# EAGLE design spaceloop_controller (EAGLE 7.6.0)
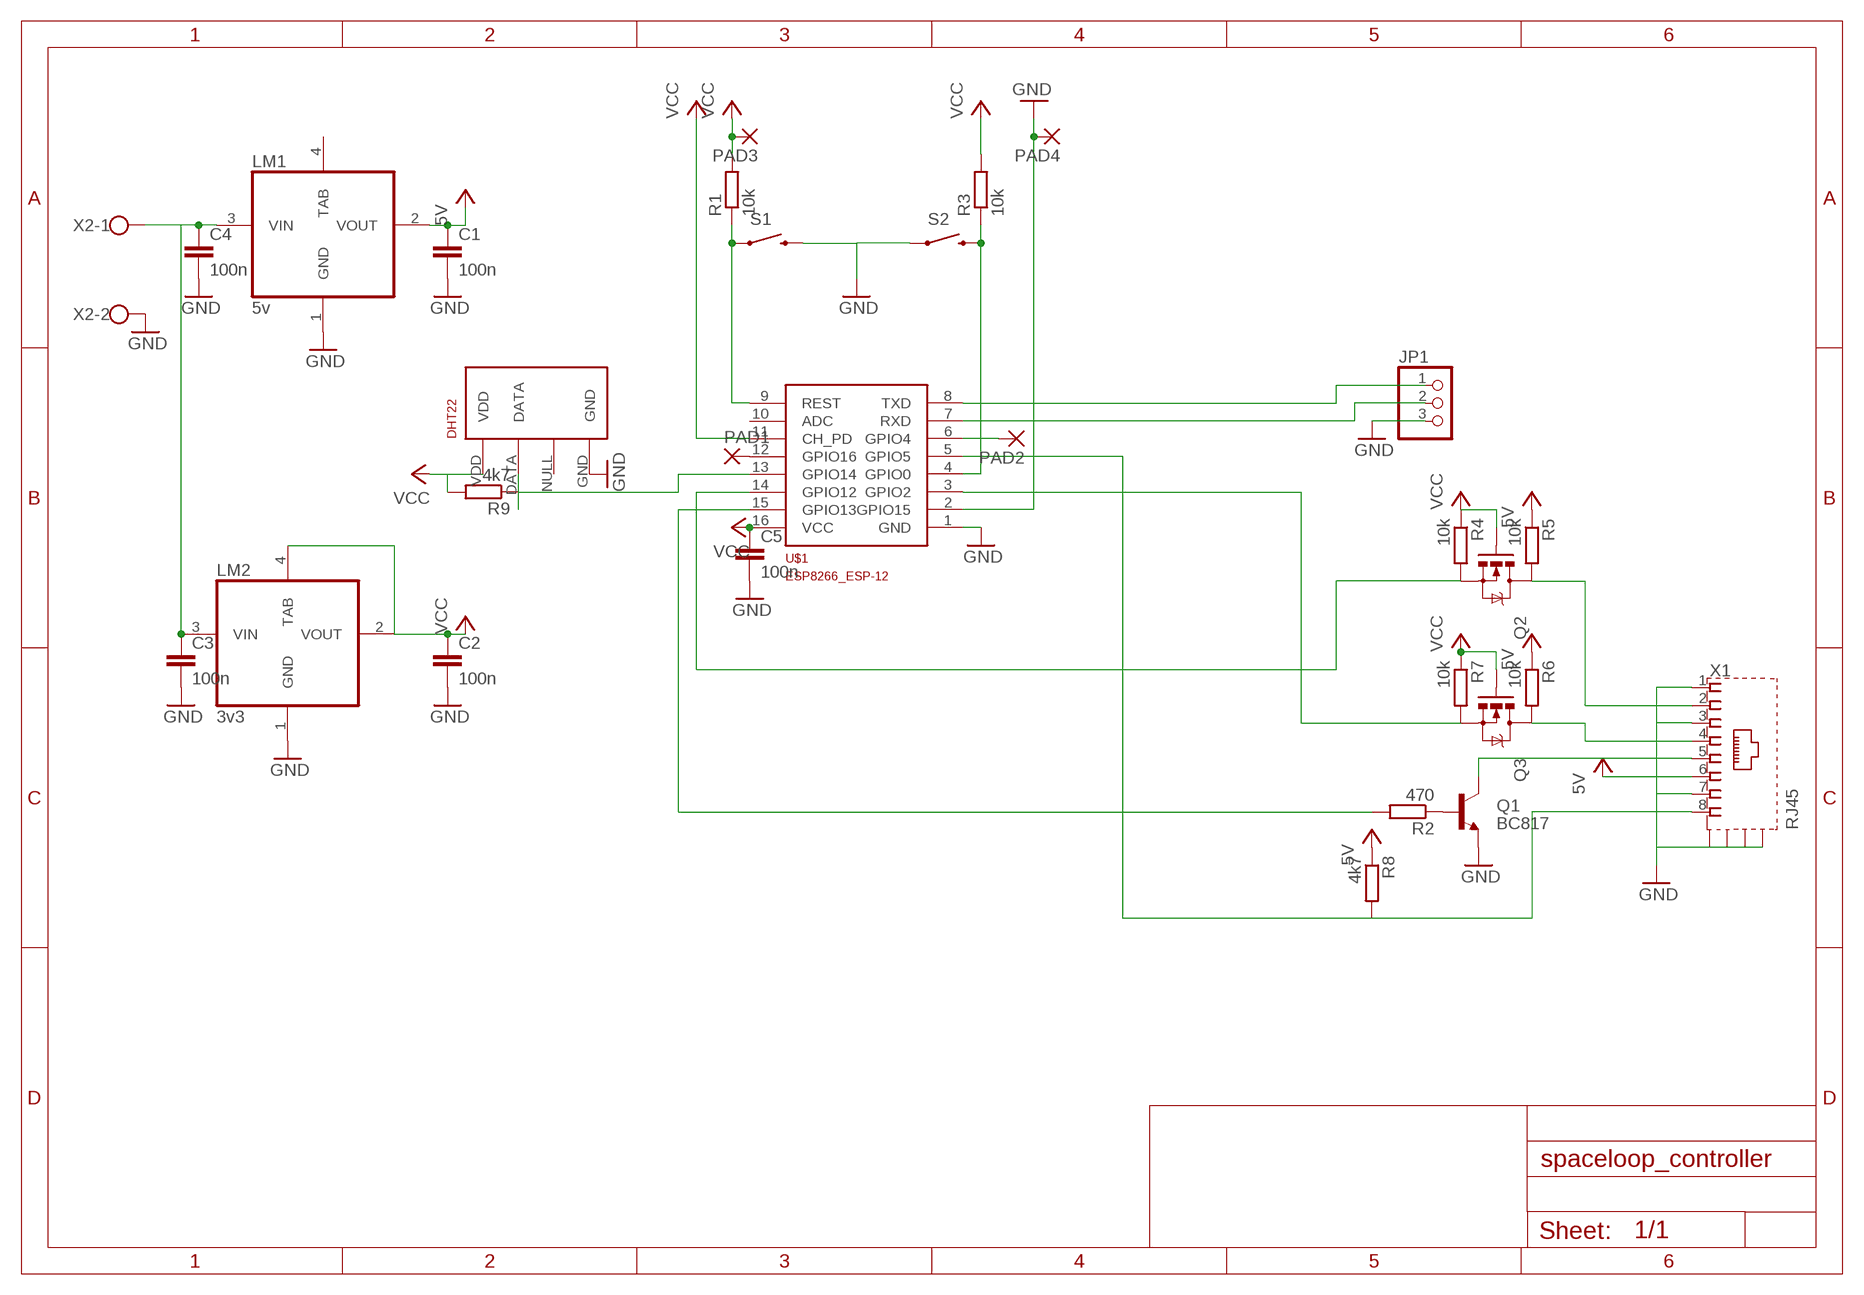
[diagram p0: schematic, sheet 1]

## Parts
C1  100n  C-EUC0805  [C0805]
C2  100n  C-EUC0805  [C0805]
C3  100n  C-EUC0805  [C0805]
C4  100n  C-EUC0805  [C0805]
C5  100n  C-EUC0805  [C0805]
DHT22  RHT03_DHT-22_AM2302WIRED  [AM2302]
JP1  PINHD-1X3  [1X03]
LM1  5v  REG1117  [SOT223]
LM2  3v3  REG1117  [SOT223]
PAD1  SMD2  [SMD1,27-2,54]
PAD2  SMD2  [SMD1,27-2,54]
PAD3  SMD2  [SMD1,27-2,54]
PAD4  SMD2  [SMD1,27-2,54]
Q1  BC817  TRANSISTOR_NPNSOT23-3  [SOT23-3]
Q2  BSS138  MOSFET-NCHANNELBSS138  [SOT23-3]
Q3  BSS138  MOSFET-NCHANNELBSS138  [SOT23-3]
R1  10k  R-EU_R0805  [R0805]
R2  470  R-EU_R0805  [R0805]
R3  10k  R-EU_R0805  [R0805]
R4  10k  R-EU_R0805  [R0805]
R5  10k  R-EU_R0805  [R0805]
R6  10k  R-EU_R0805  [R0805]
R7  10k  R-EU_R0805  [R0805]
R8  4k7  R-EU_R0805  [R0805]
R9  4k7  R-EU_R0805  [R0805]
S1  SWITCH-MOMENTARY-2SMD-1101NE  [TACTILE-SWITCH-1101NE]
S2  SWITCH-MOMENTARY-2SMD-1101NE  [TACTILE-SWITCH-1101NE]
U$1  ESP8266_ESP-12  [ESP8266-ESP12]
X1  RJ45  RJ45-6L2-B  [RJ45-SHIELD2]
X2  W237-102  [W237-102]

## Nets
+5V: C1.1 LM1.2(VOUT) R5.1 R6.1 R8.1 X1.6 ; supply symbol labelled 5V
GND: C1.2 C2.2 C3.2 C4.2 C5.2 DHT22.GND JP1.3 LM1.1(GND) LM2.1(GND) PAD4.1(P) Q1.2(E) S1.2 S2.1 U$1.1(GND) U$1.2(GPIO15) X1.1 X1.3 X1.7 X1.S1(S) X1.S2(S) X1.S3(S) X1.S4(S) X2.2
N$1: Q1.1(B) R2.1
N$2: Q1.3(C) X1.5
N$3: JP1.1 U$1.8(TXD)
N$4: JP1.2 U$1.7(RXD)
N$5: R1.1 S1.1 U$1.9(REST)
N$6: R3.1 S2.2 U$1.4(GPIO0)
N$7: PAD1.1(P) U$1.12(GPIO16)
N$8: Q2.2(S) R4.2 U$1.14(GPIO12)
N$10: Q3.2(S) R7.2 U$1.3(GPIO2)
N$11: Q3.3(D) R6.2 X1.4
N$12: R8.2 U$1.5(GPIO5) X1.8
N$13: PAD2.1(P) U$1.6(GPIO4)
N$14: R2.2 U$1.15(GPIO13)
N$16: DHT22.DATA R9.1 U$1.13(GPIO14)
N$17: C3.1 C4.1 LM1.3(VIN) LM2.3(VIN) X2.1
N$18: Q2.3(D) R5.2 X1.2
VCC: C2.1 C5.1 DHT22.VDD LM2.2(VOUT) LM2.4(TAB) PAD3.1(P) Q2.1(G) Q3.1(G) R1.2 R3.2 R4.1 R7.1 R9.2 U$1.11(CH_PD) U$1.16(VCC)
Unconnected: DHT22.NULL LM1.4(TAB) U$1.10(ADC)

## Library data of the parts
C1-C5 = rcl:C-EU: CAPACITOR, European symbol
DHT22 = RHT03_DHT-22_AM2302:RHT03_DHT-22_AM2302: RHT03 / DHT-22 / AM2302 Packages and symbol for the RHT03 / DHT-22 relative humidity and temperature sensor. Note: The AM2302 is a wired version of the DHT-22 which typically requires less clearance and is thus provided as a separate package.; PROD_ID: SEN-10167
JP1 = pinhead:PINHD-1X3: PIN HEADER
LM1 LM2 = BaseApp:REG1117: 800mA and 1A Low Dropout (LDO) Positive Regulator 1.8V, 2.5V, 2.85V, 3.3V, 5V, and Adj Digikey No :- __LM1117MPX-3.3CT-ND__
PAD1-PAD4 = wirepad:SMD2: SMD PAD
Q1 = SparkFun-DiscreteSemi:TRANSISTOR_NPN: Generic NPN BJT MMBT2222A - TRANS-08049 (SOT-23, 1A 40V) MPSA42 - TRANS-09116 (SOT-23, 500mA 300V) MMBT5088LT1G - TRANS-11160 (SOT-23, 50 mA 30V) BC547 - COM-08928 <http://www.sparkfun.com/products/8928> (TO-92 45V 100mA) (1.Collector 2.Base 3.Emitter) 2N3904 - COM-00521 <http://www.sparkfun.com/products/521> (TO-92 40V 200mA) (1.Emitter 2.Base 3.Collector) P2N2222A - COM-12852 <http://www.sparkfun.com/products/12852> (TO-92 40V 600mA) (1.Collector 2.Base 3.Emitter); PROD_ID: TRANS-08049
Q2 Q3 = SparkFun-DiscreteSemi:MOSFET-NCHANNEL: Common NMOSFET Parts MFG P/N Store ID Prod ID FDD8780 TRANS-09984 SI7820DN TRANS-11055 FDS6630A IC-08089 2N7002PW TRANS-11151 FQP30N06L COM-10213 TRANS-10060 BSS123LT1G TRANS-08345 BSS138 TRANS-00830 BS170 2N7000; PROD_ID: TRANS-00830; VALUE: 200mA/50V
R1-R9 = rcl:R-EU_: RESISTOR, European symbol
S1 S2 = SparkFun-Electromechanical:SWITCH-MOMENTARY-2: Various NO switches- pushbuttons, reed, etc; PROD_ID: SWCH-00815
U$1 = ESP8266-ESP12:ESP8266_ESP-12
X1 = con-tycoelectronics:RJ45*2: RJ45 Low Profile Shield Type 2 For all RJ45 L, LC, LCT and X Series Models Source: www.tycoelectronics.com .. ENG_DS_1654001_1099_RJ_L_0507.pdf; MPN: RJ45-6L2-B; OC_FARNELL: unknown; OC_NEWARK: 16R6096
X2 = con-wago-500:W237-102: WAGO SCREW CLAMP; MPN: 237-102; OC_FARNELL: unknown; OC_NEWARK: 70K9898

## Board
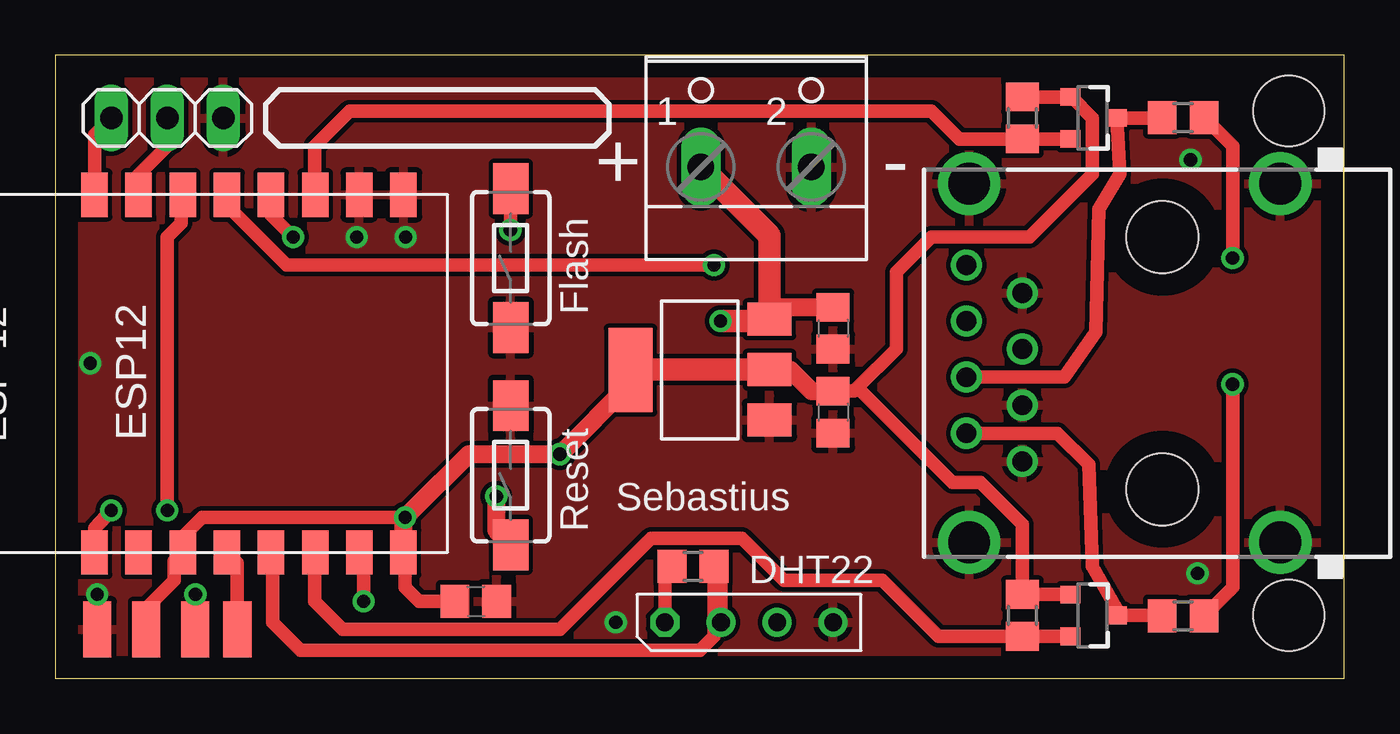
[diagram p1: board, top side]
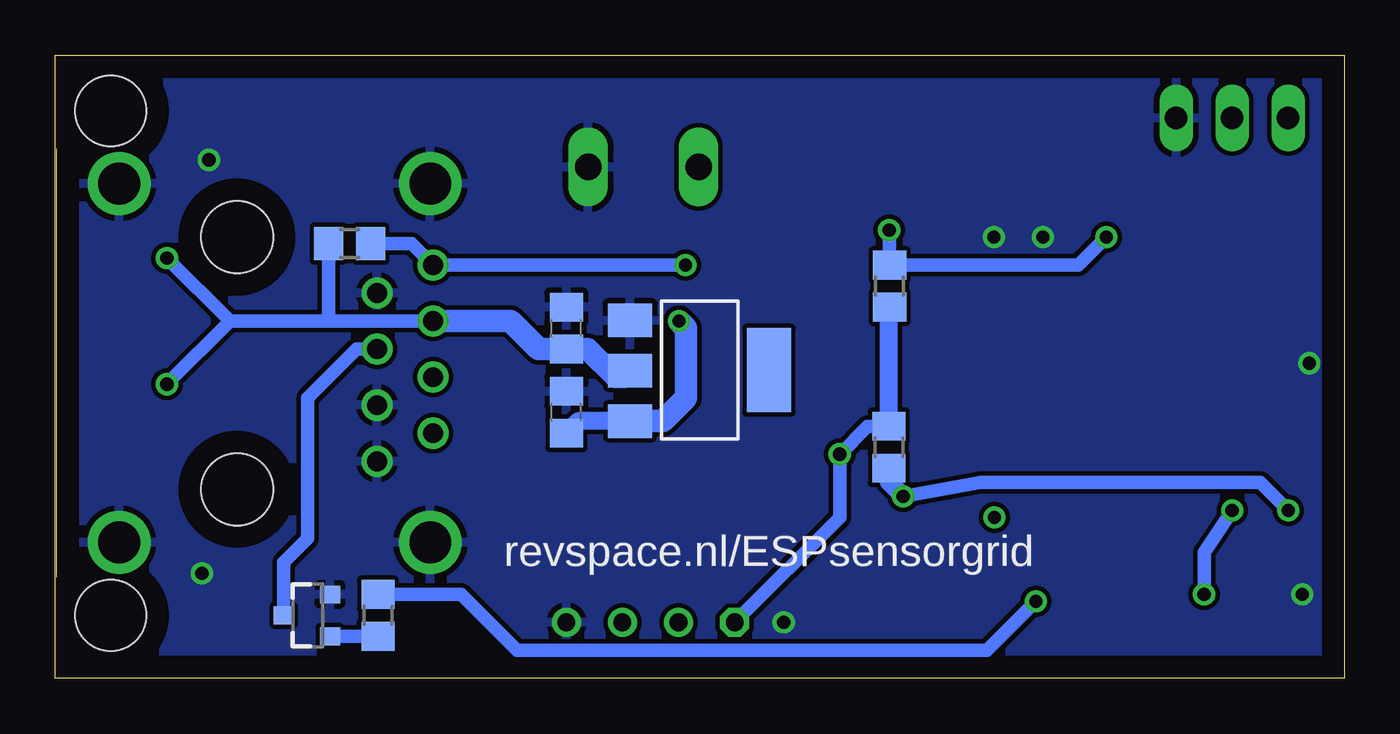
[diagram p2: board, bottom side, seen from below]

Size 58.4 x 28.25 mm. Coordinates in mm from the lower left corner, seen from the top.
Outline: 0,0 58.4,0 58.4,28.25 0,28.25 0,0
Copper layers (1*16): Top 0.035mm / dielectric 1.5mm / Bottom 0.035mm
Design rules "default": minimum track width 10mil, minimum drill 24mil, track to track 8mil, track to pad 8mil, pad to pad 8mil, via to via 8mil, smd to smd 8mil, copper to edge 40mil, drill to drill 8mil, minimum pad ring 10mil, minimum via ring 8mil, stop-mask expansion 4mil, vias tented up to drill 0mil, thermal gap 10mil
Holes 3.2 mm at 55.88,25.72 55.88,2.86

### Footprints (pad centres in the part's own frame; a part is rotated, then mirrored left to right if it is on the bottom)
C0805 = smd 1.3 x 1.5: 1 -0.95,0; 2 0.95,0
AM2302 = drill 0.8: DATA -1.27,0; GND 3.81,0; NULL 1.27,0 | drill 0.8 octagon: VDD -3.81,0
1X03 = drill 1.016 long: 1 -2.54,0; 2 0,0; 3 2.54,0
SOT223 = smd 1.499 x 2.007: 1 -2.261,-3.15; 2 0.025,-3.15; 3 2.311,-3.15 | smd 3.81 x 2.007: 4 0,3.15
SMD1,27-2,54 = smd 1.27 x 2.54: 1 0,0
SOT23-3 = smd 0.8 x 0.9: 1 -0.95,-1; 2 0.95,-1; 3 0,1.1
R0805 = smd 1.3 x 1.5: 1 -0.95,0; 2 0.95,0
TACTILE-SWITCH-1101NE = smd 2.3 x 1.6: 1 -3.15,0; 2 3.15,0
ESP8266-ESP12 = smd 2 x 1.2: 1 16.2,2; 2 16.2,4; 3 16.2,6; 4 16.2,8; 5 16.2,10; 6 16.2,12; 7 16.2,14; 8 16.2,16; 9 0,16; 10 0,14; 11 0,12; 12 0,10; 13 0,8; 14 0,6; 15 0,4; 16 0,2
RJ45-SHIELD2 = drill 0.9 pad 1.4: 1 -4.445,6.35; 2 -3.175,8.89; 3 -1.905,6.35; 4 -0.635,8.89; 5 0.635,6.35; 6 1.905,8.89; 7 3.175,6.35; 8 4.445,8.89 | drill 1.9 pad 2.5: S1 -8.128,-5.33; S2 8.128,-5.33; S3 -8.128,8.76; S4 8.128,8.76 | hole 3.251: -5.715,0; 5.715,0
W237-102 = drill 1.194 long: 1 -2.5,-1.27; 2 2.5,-1.27

### Placement (x,y rotation side)
C1  35.24,15.88 90 bottom
C2  35.24,12.06 270 top
C3  35.24,15.88 270 top
C4  35.24,12.06 90 bottom
C5  19.05,3.49 0 top
DHT22  31.43,2.54 0 top
JP1  5.08,25.4 0 top
LM1  29.21,13.97 270 bottom
LM2  29.21,13.97 90 top
PAD1  8.26,2.22 0 top
PAD2  6.35,2.22 0 top
PAD3  4.13,2.22 0 top
PAD4  1.91,2.22 0 top
Q1  46.95,2.86 90 bottom
Q2  46.99,2.86 270 top
Q3  46.99,25.4 270 top
R1  20.64,10.48 90 bottom
R2  43.77,2.86 90 bottom
R3  20.6,17.78 270 bottom
R4  43.81,2.86 270 top
R5  51.1,2.84 180 top
R6  51.1,25.42 180 top
R7  43.81,25.4 270 top
R8  45.06,19.71 0 bottom
R9  28.89,5.08 180 top
S1  20.64,9.21 90 top
S2  20.64,19.05 90 top
U$1  17.78,5.71 90 top
X1  50.16,14.29 90 top
X2  31.75,24.45 0 top

### Tracks (layer width: path | path; a pad name or v marks a point on that pad's centre or on a via)
+5V  (via drill 0.6)
  Top 0.61: v53.34,19.05 53.34,24.13 R6.1 | v53.34,13.34 53.34,4.13 R5.1
  Bottom 0.61: 50.48,16.19 v53.34,19.05 | X1.6 46.02,16.19 | 46.02,16.19 50.48,16.19 | 50.48,16.19 v53.34,13.34 | R8.1 46.02,16.19
  Bottom 1.016: X1.6 37.76,16.19 36.49,14.92 C1.1 34.27,14.93 33,13.65 32.65,13.65 LM1.2
GND  (via drill 0.6)
  other vias: 13.65,20 15.88,20 1.91,3.81 1.59,14.29 51.75,4.76 51.44,23.5 25.4,2.54
  pour Bottom: 0,27.94 0,0 58.42,0 58.42,27.94
  pour Top: 0,0 0,27.94 58.42,27.94 58.42,0
N$1
  Bottom 0.61: R2.1 Q1.1
N$2
  Bottom 0.61: Q1.3 48.05,5.27 46.97,6.35 46.97,12.7 44.75,14.92 X1.5
N$3
  Top 0.61: U$1.8 1.78,24.64 JP1.1
N$4
  Top 0.61: U$1.7 3.78,22.83 5.08,24.13 JP1.2
N$5  (via drill 0.6)
  Top 0.61: U$1.9 1.78,6.79 v2.54,7.62
  Top 0.813: v19.98,8.26 19.98,6.71 S1.1
  Bottom 0.61: v2.54,7.62 3.81,8.89 16.49,8.89 v19.98,8.26
  Bottom 0.813: R1.1 20.64,8.91 v19.98,8.26
N$6  (via drill 0.6)
  Top 0.61: S2.2 20.64,20.34 v20.62,20.32 | U$1.4 9.78,21 v10.78,20
  Bottom 0.61: v20.62,20.32 20.62,18.75 R3.1 12.04,18.73 v10.78,20
N$7
  Top 0.61: PAD1.1 8.26,5.24 U$1.12
N$8
  Top 0.61: Q2.2 R4.2 40,1.91 37.47,4.45 33.02,4.45 31.11,6.35 26.99,6.35 22.86,2.22 13.02,2.22 11.75,3.49 11.75,5.68 U$1.14
N$10
  Top 0.61: Q3.2 R7.2 40.95,24.45 39.69,25.72 13.34,25.72 11.75,24.13 11.75,21.95 U$1.3
N$11
  Top 0.61: R6.2 50.13,25.4 Q3.3 48.24,22.86 47.29,21.27 47.14,15.71 45.72,13.65 X1.4
N$12  (via drill 0.6)
  Top 0.61: U$1.5 7.78,21.43 10.48,18.73 v29.84,18.73
  Bottom 0.61: R8.2 42.25,19.7 X1.8 v29.84,18.73
N$13  (via drill 0.6)
  Top 0.61: PAD2.1 v6.35,3.81 | v5.08,7.62 5.08,20 5.71,20.64 5.71,21.85 U$1.6
  Bottom 0.61: v6.35,3.81 6.35,5.71 v5.08,7.62
N$14  (via drill 0.6)
  Top 0.61: v13.97,3.49 13.97,5.53 U$1.15
  Bottom 0.61: R2.2 40,3.81 37.47,1.27 16.19,1.27 v13.97,3.49
N$16
  Top 0.61: DHT22.DATA 30.16,4.76 R9.1 29.84,1.9 29.21,1.27 11.11,1.27 9.84,2.54 9.84,5.65 U$1.13
N$17  (via drill 0.6)
  Top 0.813: LM2.3 32.9,16.82 C3.1
  Top 1.016: X2.1 32.36,20.07 LM2.3 32.27,16.19 v30.14,16.19
  Bottom 0.813: LM1.3 34.7,11.66 C4.1
  Bottom 1.016: LM1.3 30.87,11.66 29.82,12.7 29.82,15.88 v30.14,16.19
N$18
  Top 0.61: X1.2 45.4,11.11 46.82,9.7 46.99,5.08 48.26,2.86 Q2.3 50.13,2.86 R5.2
VCC  (via drill 0.6)
  Top 0.61: Q3.1 R7.1 46.03,26.35 46.04,26.35 46.99,25.4 46.99,22.86 44.13,20 39.69,20 38.1,18.41 38.1,14.92 36.35,13.18 | Q2.1 R4.1 43.81,6.99 41.91,8.89 40.64,8.89 36.35,13.18 | 36.35,13.18 36.2,13.02 C2.1 | DHT22.VDD 27.62,4.76 R9.2 | v15.86,7.3 6.67,7.3 5.78,6.42 U$1.11 5.4,5.33 5.4,4.45 4.13,3.17 PAD3.1 | C5.1 16.49,3.49 15.86,4.13 15.86,5.64 U$1.16
  Top 0.813: LM2.2 33.29,13.99 34.27,13.02 C2.1 | U$1.16 15.78,7.23 v15.86,7.3 17.44,8.89 17.46,8.89 18.73,10.16 v22.86,10.16 26.06,13.36 LM2.4
  Top 1.016: LM2.4 26.09,13.99 LM2.2
  Bottom 0.61: DHT22.VDD 22.86,7.3 v22.86,10.16 21.59,11.43 R1.2
  Bottom 0.813: R1.2 20.64,16.79 R3.2

### Text on the board
tPlace: + | - | Flash | ESP12 | Sebastius | Reset
bPlace: revspace.nl/ESPsensorgrid
tValues: SpaceLoop 3 | BSS138 | BSS138